# EasyEDA Pro project Space_Hexapod_V2.1.eprj, board Power
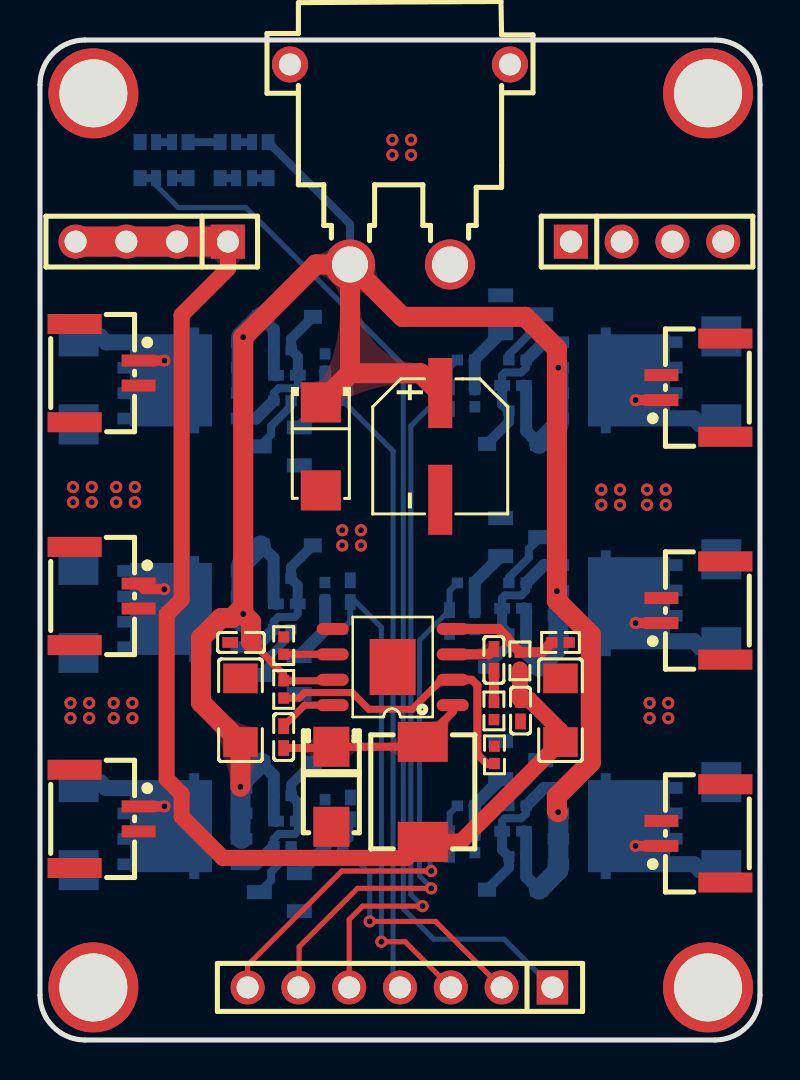
[diagram p2: board, top side]
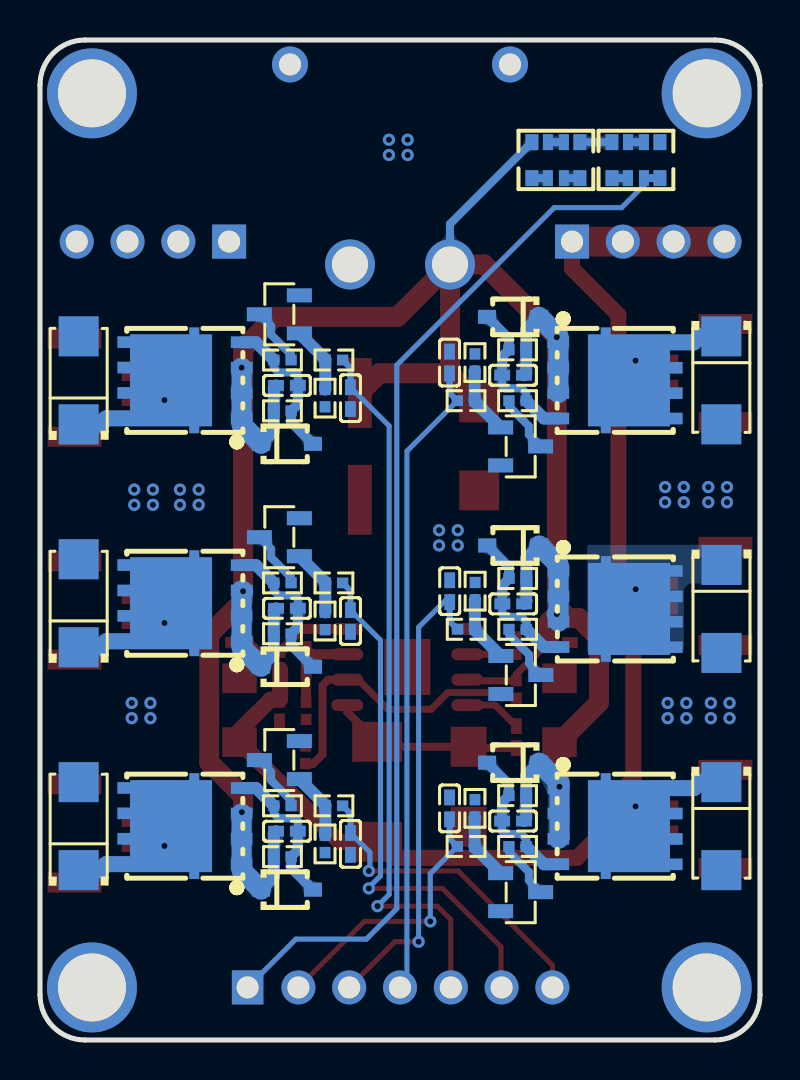
[diagram p3: board, bottom side, seen from below]

Outline 36 x 50 mm; copper layers: Top Layer, Bottom Layer. Coordinates in mm from the lower left corner of the outline.
Outline path: 0,47.75 0,2.25 arc(0.66,0.66) 2.25,0 33.75,0 arc(35.34,0.66) 36,2.25 36,47.75 arc(35.34,49.34) 33.75,50 2.25,50 arc(0.66,49.34) 0,47.75
Stack: Top Layer 0.035mm / Dielectric1 1.51mm FR4 er 4.5 / Bottom Layer 0.035mm

## Design rules (mm)
template: 自定义配置
spacing copperThickness1oz (default): track to track 0.102, other pairs 0.152 to 0.3
spacing copperThickness2oz: track to track 0.203, other pairs 0.152 to 0.3
track width copperThickness1oz (default): min 0.127, default 0.254, max 2.54
track width copperThickness2oz: min 0.203, default 0.254, max 2.54
differential pair differentialPair (default): width min 0.127, default 0.254, max 2.54; gap min 0.152, default 0.152
via viaSize (default): diameter min 0.5, default 0.61, max 10; hole min 0.3, default 0.305, max 6.3
pour e1097 uses copperRegion

## Placement (name value [footprint] x y rotation side)
C1  100pF  [C0402]  22.7 19 90 top
C2  100n  [C0402]  12.18 15.15 270 top
C3  100n  [C0402]  24.03 16.47 90 top
C4  10uF  [C1206]  26.03 16.49 90 top
C5  10uF  [C1206]  10.02 16.49 90 top
C6  100nF  [C0402]  10.05 19.88 0 top
C7  100uF  [CAP-SMD_BD6.3-L6.6-W6.6-LS7.6-FD-1]  20.01 29.68 270 top
C8  100nF  [C0402]  15.52 33.87 270 bottom
C9  100nF  [C0402]  12.35 33.24 180 bottom
C10  100nF  [C0402]  20.48 32.09 90 bottom
C11  100nF  [C0402]  23.65 32.73 0 bottom
C12  100nF  [C0402]  15.51 22.44 270 bottom
C13  100nF  [C0402]  12.34 21.81 180 bottom
C14  100nF  [C0402]  23.65 21.58 0 bottom
C15  100nF  [C0402]  20.48 20.95 90 bottom
C16  100nF  [C0402]  15.52 11.58 270 bottom
C17  100nF  [C0402]  20.48 9.8 90 bottom
C18  100nF  [C0402]  12.35 10.95 180 bottom
C19  100nF  [C0402]  23.65 10.44 0 bottom
CN1  XT30PW-M  [CONN-TH_XT30PW-M]  18 43.78 180 top
CN2  GT-A1257WRS-102SBT01  [CONN-SMD_2P-P1.25_A1254-2AWB]  3.33 33.34 270 top
CN3  GT-A1257WRS-102SBT01  [CONN-SMD_2P-P1.25_A1254-2AWB]  32.67 32.62 90 top
CN4  GT-A1257WRS-102SBT01  [CONN-SMD_2P-P1.25_A1254-2AWB]  3.33 22.2 270 top
CN5  GT-A1257WRS-102SBT01  [CONN-SMD_2P-P1.25_A1254-2AWB]  32.67 21.47 90 top
CN6  GT-A1257WRS-102SBT01  [CONN-SMD_2P-P1.25_A1254-2AWB]  3.33 11.06 270 top
CN7  GT-A1257WRS-102SBT01  [CONN-SMD_2P-P1.25_A1254-2AWB]  32.67 10.33 90 top
D1  SS34  [SMA_L4.2-W2.7-LS5.0-RD]  14.57 12.66 270 top
D2  SMAJ26A  [SMA_L4.3-W2.6-LS5.1-RD]  14.04 29.68 270 top
D3  SMAJ26A  [SMA_L4.3-W2.6-LS5.1-RD]  1.93 32.98 270 bottom
D4  SMAJ26A  [SMA_L4.3-W2.6-LS5.1-RD]  34.07 32.98 90 bottom
D5  BZT52C10S  [SOD-323_L1.6-W1.3-LS2.7-RD]  12.35 36.16 0 bottom
D6  BZT52C10S  [SOD-323_L1.6-W1.3-LS2.7-RD]  23.65 29.81 180 bottom
D7  SMAJ26A  [SMA_L4.3-W2.6-LS5.1-RD]  1.93 21.55 270 bottom
D8  SMAJ26A  [SMA_L4.3-W2.6-LS5.1-RD]  34.07 21.84 90 bottom
D9  BZT52C10S  [SOD-323_L1.6-W1.3-LS2.7-RD]  12.34 24.73 0 bottom
D10  BZT52C10S  [SOD-323_L1.6-W1.3-LS2.7-RD]  23.65 18.66 180 bottom
D11  SMAJ26A  [SMA_L4.3-W2.6-LS5.1-RD]  1.93 10.69 270 bottom
D12  SMAJ26A  [SMA_L4.3-W2.6-LS5.1-RD]  34.07 10.69 90 bottom
D13  BZT52C10S  [SOD-323_L1.6-W1.3-LS2.7-RD]  12.35 13.87 0 bottom
D14  BZT52C10S  [SOD-323_L1.6-W1.3-LS2.7-RD]  23.65 7.52 180 bottom
H1  PM254V-11-07-H85  [HDR-TH_7P-P2.54-V-F]  18 2.63 180 top
H6  2.54-1*4P母  [HDR-TH_4P-P2.54-V-F]  5.59 39.92 180 top
H8  2.54-1*4P母  [HDR-TH_4P-P2.54-V-F]  30.35 39.92 0 top
L1  4.7uH  [IND-SMD_L5.9-W5.2]  19.14 12.41 270 top
NOREF  -  [Pad_e34]  33.4 2.63 0 top
NOREF#2  -  [Pad_e35]  33.4 47.33 0 top
NOREF#3  -  [Pad_e33]  2.67 2.63 0 top
NOREF#4  -  [Pad_e32]  2.67 47.33 0 top
Q1  HYG110P04LQ2C2  [PDFN-8_L5.2-W5.9-P1.27-LS6.2-BL]  7.25 32.98 270 bottom
Q2  HYG110P04LQ2C2  [PDFN-8_L5.2-W5.9-P1.27-LS6.2-BL]  28.75 32.98 90 bottom
Q3  BSS138  [SOT-23-3_L2.9-W1.3-P1.90-LS2.4-BR]  11.97 29.68 0 bottom
Q4  BSS138  [SOT-23-3_L2.9-W1.3-P1.90-LS2.4-BR]  24.03 36.28 180 bottom
Q5  HYG110P04LQ2C2  [PDFN-8_L5.2-W5.9-P1.27-LS6.2-BL]  7.24 21.55 270 bottom
Q6  HYG110P04LQ2C2  [PDFN-8_L5.2-W5.9-P1.27-LS6.2-BL]  28.75 21.84 90 bottom
Q7  BSS138  [SOT-23-3_L2.9-W1.3-P1.90-LS2.4-BR]  11.96 18.25 0 bottom
Q8  BSS138  [SOT-23-3_L2.9-W1.3-P1.90-LS2.4-BR]  24.03 25.14 180 bottom
Q9  HYG110P04LQ2C2  [PDFN-8_L5.2-W5.9-P1.27-LS6.2-BL]  7.25 10.69 270 bottom
Q10  HYG110P04LQ2C2  [PDFN-8_L5.2-W5.9-P1.27-LS6.2-BL]  28.75 10.69 90 bottom
Q11  BSS138  [SOT-23-3_L2.9-W1.3-P1.90-LS2.4-BR]  11.97 7.39 0 bottom
Q12  BSS138  [SOT-23-3_L2.9-W1.3-P1.90-LS2.4-BR]  24.03 14 180 bottom
R1  100k  [R0402]  22.7 16.45 270 top
R2  8.2k  [R0402]  26.03 19.88 0 top
R3  100kΩ  [R0402]  12.18 19.72 90 top
R4  100kΩ  [R0402]  12.18 17.53 90 top
R5  100kΩ  [R0402]  22.72 14.26 90 top
R6  44.2kΩ  [R0402]  23.99 18.96 270 top
R7  1kΩ  [R0402]  14.7 31.97 0 bottom
R8  1kΩ  [R0402]  21.3 34 180 bottom
R9  10kΩ  [R0402]  12.12 34.51 180 bottom
R10  10kΩ  [R0402]  14.25 33.87 270 bottom
R11  1kΩ  [R0402]  12.12 31.97 0 bottom
R12  10kΩ  [R0402]  23.88 31.46 0 bottom
R13  10kΩ  [R0402]  21.75 32.09 90 bottom
R14  1kΩ  [R0402]  23.88 34 180 bottom
R15  1kΩ  [R0402]  14.69 20.54 0 bottom
R16  1kΩ  [R0402]  21.3 22.85 180 bottom
R17  10kΩ  [R0402]  12.12 23.08 180 bottom
R18  10kΩ  [R0402]  14.24 22.44 270 bottom
R19  10kΩ  [R0402]  23.88 20.31 0 bottom
R20  10kΩ  [R0402]  21.75 20.95 90 bottom
R21  1kΩ  [R0402]  12.12 20.54 0 bottom
R22  1kΩ  [R0402]  23.88 22.85 180 bottom
R23  1kΩ  [R0402]  14.7 9.68 0 bottom
R24  1kΩ  [R0402]  21.3 11.71 180 bottom
R25  10kΩ  [R0402]  12.12 12.22 180 bottom
R26  10kΩ  [R0402]  14.25 11.58 270 bottom
R27  10kΩ  [R0402]  23.88 9.17 0 bottom
R28  10kΩ  [R0402]  21.75 9.8 90 bottom
R29  1kΩ  [R0402]  12.12 9.68 0 bottom
R30  1kΩ  [R0402]  23.88 11.71 180 bottom
RN1  1kΩ  [RES-ARRAY-SMD_0603-8P-L3.2-W1.6-BL]  10.21 43.99 180 bottom
RN2  1kΩ  [RES-ARRAY-SMD_0603-8P-L3.2-W1.6-BL]  6.2 43.99 180 bottom
U1  MP1584EN-LF-P  [SOIC-8_L4.9-W3.9-P1.27-LS6.0-TL-EP-1]  17.62 18.63 180 top

## Footprints (pads in the part's own frame, mm; a bottom-side part is the same pattern mirrored in y, then rotated)
C0402
  rect 0.79x0.54 smd: 1(-0.545,0) 2(0.545,0)
C1206
  rect 1.485x1.728 smd: 1(-1.593,0) 2(1.593,0)
CAP-SMD_BD6.3-L6.6-W6.6-LS7.6-FD-1
  rect 3.5x1.2 smd: 1(-2.67,0) 2(2.67,0)
CONN-SMD_2P-P1.25_A1254-2AWB
  rect 0.6x1.7 smd: 1(-0.625,1.6) 2(0.625,1.6)
  rect 1x2.7 smd: 3(-2.455,-1.6) 4(2.455,-1.6)
CONN-TH_XT30PW-M
  round 2.5 hole 1.8: 1(-2.5,5) 2(2.5,5)
  round 1.8 hole 1.1: 3(5.5,-5) 4(-5.5,-5)
HDR-TH_4P-P2.54-V-F
  rect 1.7x1.7 hole 1.1: 1(-3.81,0)
  round 1.7 hole 1.1: 2(-1.27,0) 3(1.27,0) 4(3.81,0)
HDR-TH_7P-P2.54-V-F
  rect 1.575x1.7 hole 1.1: 1(-7.62,0)
  round 1.7 hole 1.1: 2(-5.08,0) 3(-2.54,0) 4(0,0) 5(2.54,0) 6(5.08,0) 7(7.62,0)
IND-SMD_L5.9-W5.2
  rect 2x2.5 smd: 1(-2.5,0) 2(2.5,0)
Pad_e32
  round 4.5 hole 3.4: 1(0,0)
Pad_e33
  round 4.5 hole 3.4: 1(0,0)
Pad_e34
  round 4.5 hole 3.4: 1(0,0)
Pad_e35
  round 4.5 hole 3.4: 1(0,0)
PDFN-8_L5.2-W5.9-P1.27-LS6.2-BL
  rect 0.58x1.079 smd: 1(-1.905,-2.834) 2(-0.635,-2.834) 3(0.635,-2.834) 4(1.905,-2.834)
  rect 0.58x1.08 smd: 5(1.91,2.834) 6(0.64,2.834) 7(-0.63,2.834) 8(-1.9,2.834)
  rect 0.95x0.5 smd: 9(-2.169,-0.465) 9(2.169,-0.465)
  rect 4.6x4.1 smd: 9(0,0.695)
R0402
  rect 0.566x0.54 smd: 1(-0.433,0) 2(0.433,0)
RES-ARRAY-SMD_0603-8P-L3.2-W1.6-BL
  rect 0.65x0.8 smd: 1(-1.2,-0.9) 4(1.2,-0.9) 5(1.2,0.9) 8(-1.2,0.9)
  rect 0.5x0.8 smd: 2(-0.4,-0.9) 3(0.4,-0.9) 6(0.4,0.9) 7(-0.4,0.9)
SMA_L4.2-W2.7-LS5.0-RD
  rect 2x1.8 smd: 1(-2,0) 2(2,0)
SMA_L4.3-W2.6-LS5.1-RD
  rect 2x2 smd: 1(-2.2,0) 2(2.2,0)
SOD-323_L1.6-W1.3-LS2.7-RD
  rect 0.9x0.7 smd: 1(-1.3,0) 2(1.3,0)
SOIC-8_L4.9-W3.9-P1.27-LS6.0-TL-EP-1
  oval 1.6x0.6 smd: 1(-3.018,1.887) 2(-3.018,0.617) 3(-3.018,-0.653) 4(-3.018,-1.923) 5(2.982,-1.923) 6(2.982,-0.653) 7(2.982,0.617) 8(2.982,1.887)
  rect 2.3x2.8 smd: 9(-0.018,-0.018)
SOT-23-3_L2.9-W1.3-P1.90-LS2.4-BR
  rect 1.25x0.7 smd: 1(1,-0.95) 2(1,0.95) 3(-1,0)

## Nets
5V: C3.2 C4.1 H6.1 H6.2 H6.3 H6.4 L1.2 R6.2
GND: C3.1 C4.2 C5.2 C6.1 C7.2 C8.1 C10.1 C12.1 C15.1 C16.1 C17.1 CN1.1 CN1.3 CN1.4 CN2.2 CN3.2 CN4.2 CN5.2 CN6.2 CN7.2 D1.2 D2.2 D3.2 D4.2 D7.2 D8.2 D11.2 D12.2 H8.1 H8.2 H8.3 H8.4 NOREF.1 NOREF#2.1 NOREF#3.1 NOREF#4.1 Q3.2 Q4.2 Q7.2 Q8.2 Q11.2 Q12.2 R1.2 R2.2 R3.2 R5.2 R10.1 R13.1 R18.1 R20.1 R26.1 R28.1 RN2.5 U1.5 U1.9
VIN: C5.1 C6.2 C7.1 C9.2 C11.2 C13.2 C14.2 C18.2 C19.2 CN1.2 D2.1 D5.1 D6.1 D9.1 D10.1 D13.1 D14.1 Q1.1 Q1.2 Q1.3 Q2.1 Q2.2 Q2.3 Q5.1 Q5.2 Q5.3 Q6.1 Q6.2 Q6.3 Q9.1 Q9.2 Q9.3 Q10.1 Q10.2 Q10.3 R4.2 R9.2 R12.2 R17.2 R19.2 R25.2 R27.2 RN1.8 U1.7
IO5: C10.2 H1.5 R8.2
IO12: C8.2 H1.4 R7.2
IO14: C12.2 H1.3 R15.2
IO18: C15.2 H1.6 R16.2
IO19: C17.2 H1.7 R24.2
IO25: H1.1 RN2.3 RN2.4
IO27: C16.2 H1.2 R23.2
VOUT1: CN2.1 D3.1 Q1.5 Q1.6 Q1.7 Q1.8 Q1.9
VOUT2: CN4.1 D7.1 Q5.5 Q5.6 Q5.7 Q5.8 Q5.9
VOUT3: CN6.1 D11.1 Q9.5 Q9.6 Q9.7 Q9.8 Q9.9
VOUT4: CN3.1 D4.1 Q2.5 Q2.6 Q2.7 Q2.8 Q2.9
VOUT5: CN5.1 D8.1 Q6.5 Q6.6 Q6.7 Q6.8 Q6.9
VOUT6: CN7.1 D12.1 Q10.5 Q10.6 Q10.7 Q10.8 Q10.9
$2N4222: C9.1 D5.2 Q1.4 R9.1 R11.1
$2N4227: Q3.1 R7.1 R10.2
$2N23262: C1.2 U1.3
$2N23263: C1.1 R1.1
$2N23269: R2.1 R6.1 U1.4
$2N23273: C2.1 U1.8
$2N23274: R3.1 U1.6
$2N23279: R4.1 R5.1 U1.2
$2N23281: C2.2 D1.1 L1.1 U1.1
$2N23284: RN1.3 RN1.4
$2N23285: RN2.1 RN2.2
$2N23286: RN1.1 RN1.2
$2N23290: RN1.6 RN1.7
$2N23291: RN1.5 RN2.8
$2N23292: RN2.6 RN2.7
$2N31785: Q3.3 R11.2
$2N40147: Q7.3 R21.2
$2N40149: Q7.1 R15.1 R18.2
$2N40150: C13.1 D9.2 Q5.4 R17.1 R21.1
$2N43559: Q11.1 R23.1 R26.2
$2N43564: C18.1 D13.2 Q9.4 R25.1 R29.1
$2N43565: Q11.3 R29.2
$2N44625: Q8.1 R16.1 R20.2
$2N44632: Q8.3 R22.2
$2N44634: C14.1 D10.2 Q6.4 R19.1 R22.1
$2N47079: C11.1 D6.2 Q2.4 R12.1 R14.1
$2N47085: Q4.1 R8.1 R13.2
$2N47089: Q4.3 R14.2
$2N47612: C19.1 D14.2 Q10.4 R27.1 R30.1
$2N47618: Q12.1 R24.1 R28.2
$2N47622: Q12.3 R30.2

Pads without a net: CN2 3 4; CN3 3 4; CN4 3 4; CN5 3 4; CN6 3 4; CN7 3 4

## Via types
v1: diameter 0.61, hole 0.305, Top Layer to Bottom Layer, 53 vias

## Routing (per net, layer and track width the routed paths; a pad name or vN(x,y) marks a point on that pad's centre or on a via; arc(x,y) is an arc through that point)
5V: length 64.9
  Top Layer w0.8: H6.1 9.4,38.57 7.08,36.25 7.08,22.03 6.33,21.28 6.33,13.05 7.08,12.3 7.08,11.17 9.14,9.11 18.34,9.11 L1.2 21.04,9.91 C4.1 26.03,15.46 24.47,17.02 C3.2 23.99,17.05 R6.2
  Top Layer w1.5: H6.1 H6.2 H6.3 H6.4
GND:
  vias: v1(1.52,16.85) v1(1.52,16.09) v1(1.65,27.65) v1(1.65,26.89) v1(2.46,16.85) v1(2.46,16.09) v1(2.59,27.65) v1(2.59,26.89) v1(3.68,16.85) v1(3.68,16.09) v1(3.81,27.65) v1(3.81,26.89) v1(4.62,16.85) v1(4.62,16.09) v1(4.74,27.65) v1(4.74,26.89) v1(15.11,25.49) v1(15.11,24.73) v1(16.05,25.49) v1(16.05,24.73) v1(17.62,45.01) v1(17.62,44.25) v1(18.55,45.01) v1(18.55,44.25) v1(28.07,27.52) v1(28.07,26.76) v1(29,27.52) v1(29,26.76) v1(30.35,27.52) v1(30.35,26.76) v1(30.48,16.85) v1(30.48,16.09) v1(31.29,27.52) v1(31.29,26.76) v1(31.41,16.85) v1(31.41,16.09)
VIN: length 140.2
  Top Layer w0.35: C6.2 11.59,18.89 11.59,18.87 11.78,18.68 11.8,18.68 12.18,18.29 R4.2 14.58,17.96 U1.7
  Top Layer w1: v1(10.16,21.3) 10.55,20.91 10.55,19.92 C6.2 ; v1(10.16,21.3) 9.98,21.48 9.6,21.1 9.05,21.1 8.05,20.1 8.05,16.87 C5.1 v1(10.02,12.66) ; v1(10.16,21.3) v1(10.16,35.14) 13.8,38.78 CN1.2 ; C7.1 19.02,33.34 15.5,33.34 ; v1(25.91,11.39) 25.84,11.46 25.84,12.19 27.54,13.89 27.54,20.27 25.84,21.97 v1(25.84,22.44) 25.84,34.57 24.26,36.16 18.12,36.16 CN1.2 ; CN1.2 15.5,33.34 ; 15.5,33.34 D2.1
  Bottom Layer w0.4: RN1.8 15.5,40.8 CN1.2
  Bottom Layer w0.6: C9.2 11.69,33.35 11.69,35.51 D5.1 ; C11.2 24.31,32.62 24.31,30.45 D6.1 ; D14.1 24.31,8.16 24.31,10.33 C19.2 ; D13.1 11.69,13.22 11.69,11.06 C18.2 ; D9.1 11.68,24.08 R17.2 11.68,21.92 C13.2 ; D10.1 24.31,19.31 24.31,21.47 C14.2
  Bottom Layer w1: Q10.3 Q10.2 Q10.1 25.92,8.48 D14.1 ; D5.1 10.08,35.19 Q1.1 Q1.2 Q1.3 ; Q9.3 10.02,10.11 v1(10.02,12.66) 10.02,12.84 D13.1 ; 10.08,21.2 10.16,21.28 v1(10.16,21.3) ; v1(25.84,22.44) 25.89,22.44 Q6.3 Q6.2 Q6.1 25.92,19.63 D10.1 ; Q5.3 Q5.2 10.07,23.76 D9.1 ; D6.1 25.92,30.77 Q2.1 Q2.2 v1(25.92,33.62)
IO5: length 35.8
  Top Layer w0.254: H1.5 15.46,6.02 16.13,6.69 v1(19.13,6.69)
  Bottom Layer w0.254: v1(19.13,6.69) 18.54,7.28 18.54,30.7 C10.2
  Bottom Layer w0.3: R8.2 20.48,33.61 C10.2
IO12: length 32
  Bottom Layer w0.254: R7.2 17.65,29.44 17.65,2.98 H1.4
  Bottom Layer w0.3: R7.2 15.52,32.36 C8.2
IO14: length 23.8
  Top Layer w0.254: H1.3 18.25,4.92 v1(17.07,4.92)
  Bottom Layer w0.254: v1(17.07,4.92) 17.07,20.64 15.52,22.18
  Bottom Layer w0.3: C12.2 15.51,20.93 R15.2
IO18: length 26.2
  Top Layer w0.254: H1.6 12.95,2.66 12.95,4.66 15.88,7.58 v1(19.56,7.58)
  Bottom Layer w0.254: C15.2 18.97,19.99 18.97,8.21 19.56,7.62 v1(19.56,7.58)
  Bottom Layer w0.3: C15.2 20.48,22.46 R16.2
IO19: length 16.1
  Top Layer w0.254: H1.7 10.38,3.74 15.09,8.45 v1(19.56,8.45)
  Bottom Layer w0.254: C17.2 19.51,9.38 19.51,8.5 v1(19.56,8.45)
  Bottom Layer w0.3: C17.2 20.48,11.32 R24.2
IO25: length 53.5
  Bottom Layer w0.254: RN2.3 5.8,42.73 6.92,41.62 10.29,41.62 18.16,33.74 18.16,6.57 19.69,5.04 23.21,5.04 H1.1
  Bottom Layer w0.4: RN2.3 RN2.4
IO27: length 13.8
  Top Layer w0.254: H1.2 19.78,5.93 v1(16.49,5.93)
  Bottom Layer w0.254: R23.2 16.49,8.32 v1(16.49,5.93)
  Bottom Layer w0.3: C16.2 15.52,10.07 R23.2
VOUT1: length 3.9
  Top Layer w0.5: 4.93,33.97 v1(6.22,33.97)
  Bottom Layer w0.8: Q1.8 3.31,34.88 3.01,35.18 D3.1
VOUT2: length 1.4
  Top Layer w0.5: 4.93,22.83 5.22,22.54 v1(6.21,22.54)
VOUT3: length 3.9
  Top Layer w0.5: 4.93,11.68 v1(6.22,11.68)
  Bottom Layer w0.8: D11.1 3.01,12.89 3.31,12.59 Q9.8
VOUT4: length 3.9
  Top Layer w0.5: 31.07,31.99 v1(29.78,31.99)
  Bottom Layer w0.8: D4.1 32.99,30.78 32.69,31.08 Q2.8
VOUT5: length 3.9
  Top Layer w0.5: 31.07,20.85 v1(29.78,20.85)
  Bottom Layer w0.8: D8.1 32.99,19.64 32.69,19.94 Q6.8
VOUT6: length 3.9
  Top Layer w0.5: 31.07,9.71 v1(29.78,9.71)
  Bottom Layer w0.8: D12.1 32.99,8.49 32.69,8.79 Q10.8
$2N4222: length 7.7
  Bottom Layer w0.4: 11.69,31.97 11.69,32.35 11.93,32.59 12.75,32.59 12.89,32.73 C9.1
  Bottom Layer w0.5: C9.1 12.89,34.17 R9.1 12.56,35.07 D5.2
  Bottom Layer w0.6: 11.69,31.97 10.8,31.08 Q1.4
$2N4227: length 3.4
  Bottom Layer w0.6: R10.2 14.27,33.43 R7.1 14.27,31.93 Q3.1
$2N23262: length 2.2
  Top Layer w0.5: C1.2 22.43,19.28 U1.3
$2N23263: length 1.6
  Top Layer w0.5: C1.1 R1.1
$2N23269: length 5.7
  Top Layer w0.5: R2.1 25.11,19.39 R6.1 23.49,19.89 23.49,19.91 23.37,20.04 23.37,20.11 22.92,20.55 U1.4
$2N23273: length 2.9
  Top Layer w0.35: C2.1 13.24,16.74 U1.8
$2N23274: length 2.4
  Top Layer w0.35: R3.1 14.63,19.29
$2N23279: length 15.4
  Top Layer w0.35: U1.2 20.08,18.01 18.61,16.54 16.45,16.54 15.61,17.37 13.22,17.37 12.95,17.1 R4.1
  Top Layer w0.4: 22.72,13.81 22.35,13.81 21.87,14.28 21.87,17.73 21.59,18.01 U1.2
$2N23281: length 9.5
  Top Layer w0.4: C2.2 14.51,14.6 D1.1 18.89,14.66 L1.1 20.63,16.4 U1.1
$2N23284: length 0.8
  Bottom Layer w0.4: RN1.3 RN1.4
$2N23285: length 0.8
  Bottom Layer w0.4: RN2.1 RN2.2
$2N23286: length 0.8
  Bottom Layer w0.4: RN1.1 RN1.2
$2N23290: length 0.8
  Bottom Layer w0.4: RN1.7 RN1.6
$2N23291: length 1.6
  Bottom Layer w0.4: RN1.5 RN2.8
$2N23292: length 0.8
  Bottom Layer w0.4: RN2.7 RN2.6
$2N31785: length 2.9
  Bottom Layer w0.4: R11.2 12.56,31.7 11.56,30.7 11.56,30.27 Q3.3
$2N40147: length 2.9
  Bottom Layer w0.4: R21.2 12.55,20.27 11.55,19.27 11.55,18.84 Q7.3
$2N40149: length 3.4
  Bottom Layer w0.6: Q7.1 14.26,20.5 R15.1 14.26,22 R18.2
$2N40150: length 7.7
  Bottom Layer w0.4: C13.1 12.88,21.3 12.74,21.16 11.92,21.16 11.68,20.92 R21.1
  Bottom Layer w0.5: D9.2 12.55,23.64 R17.1 12.88,22.74 C13.1
  Bottom Layer w0.6: R21.1 10.79,19.65 Q5.4
$2N43559: length 3.4
  Bottom Layer w0.6: 12.97,8.34 14.27,9.64 R23.1 14.27,11.14 R26.2
$2N43564: length 7.7
  Bottom Layer w0.4: C18.1 12.89,10.44 12.75,10.3 11.93,10.3 11.69,10.06 11.69,9.68
  Bottom Layer w0.5: C18.1 12.89,11.88 R25.1 12.56,12.78 D13.2
  Bottom Layer w0.6: 11.69,9.68 10.8,8.79 Q9.4
$2N43565: length 2.9
  Bottom Layer w0.4: R29.2 12.56,9.41 11.56,8.41 11.56,7.98 Q11.3
$2N44625: length 3.4
  Bottom Layer w0.6: Q8.1 21.73,22.89 R16.1 21.73,21.39 R20.2
$2N44632: length 2.9
  Bottom Layer w0.4: Q8.3 24.44,24.55 24.44,24.12 23.44,23.12 R22.2
$2N44634: length 7.7
  Bottom Layer w0.4: C14.1 23.11,22.09 23.25,22.23 24.07,22.23 24.31,22.47 24.31,22.85
  Bottom Layer w0.5: D10.2 23.44,19.75 R19.1 23.11,20.65 C14.1
  Bottom Layer w0.6: 24.31,22.85 25.2,23.74 Q6.4
$2N47079: length 7.7
  Bottom Layer w0.4: C11.1 23.11,33.23 23.25,33.38 24.07,33.38 24.31,33.62 24.31,34
  Bottom Layer w0.5: C11.1 23.11,31.8 R12.1 23.44,30.9 D6.2
  Bottom Layer w0.6: 24.31,34 25.2,34.89 Q2.4
$2N47085: length 3.4
  Bottom Layer w0.6: R13.2 21.73,32.54 R8.1 21.73,34.04 Q4.1
$2N47089: length 2.9
  Bottom Layer w0.4: Q4.3 24.44,35.69 24.44,35.27 23.44,34.27 R14.2
$2N47612: length 7.7
  Bottom Layer w0.4: 24.31,11.71 24.31,11.33 24.07,11.09 23.25,11.09 23.11,10.94 C19.1
  Bottom Layer w0.5: C19.1 23.11,9.51 R27.1 23.44,8.61 D14.2
  Bottom Layer w0.6: 24.31,11.71 25.2,12.6 Q10.4
$2N47618: length 3.4
  Bottom Layer w0.6: 21.75,10.24 21.73,10.25 R24.1 21.73,11.75 Q12.1
$2N47622: length 2.9
  Bottom Layer w0.4: Q12.3 24.44,13.41 24.44,12.98 23.44,11.98 R30.2

## Copper pours and planes (outline as drawn; the poured copper is in the pictures)
GND on Top Layer: -5.08,53.81 36.96,53.81 36.96,-0.67 -5.08,-0.67
GND on Bottom Layer: -0.89,56.86 40.26,56.86 40.26,-6.77 -0.89,-6.77
VOUT2 on Bottom Layer: 0.89,24.73 0.89,22.82 3.56,22.82 3.81,22.57 3.81,19.52 3.94,19.39 8.51,19.39 8.64,19.27 8.64,24.75 0.92,24.75

Small or netless copper shapes (teardrops, artwork), in the pictures only: 43 on Top Layer, 92 on Bottom Layer
